# EAGLE schematic BMS Segment rev4 (EAGLE 8.4.1)
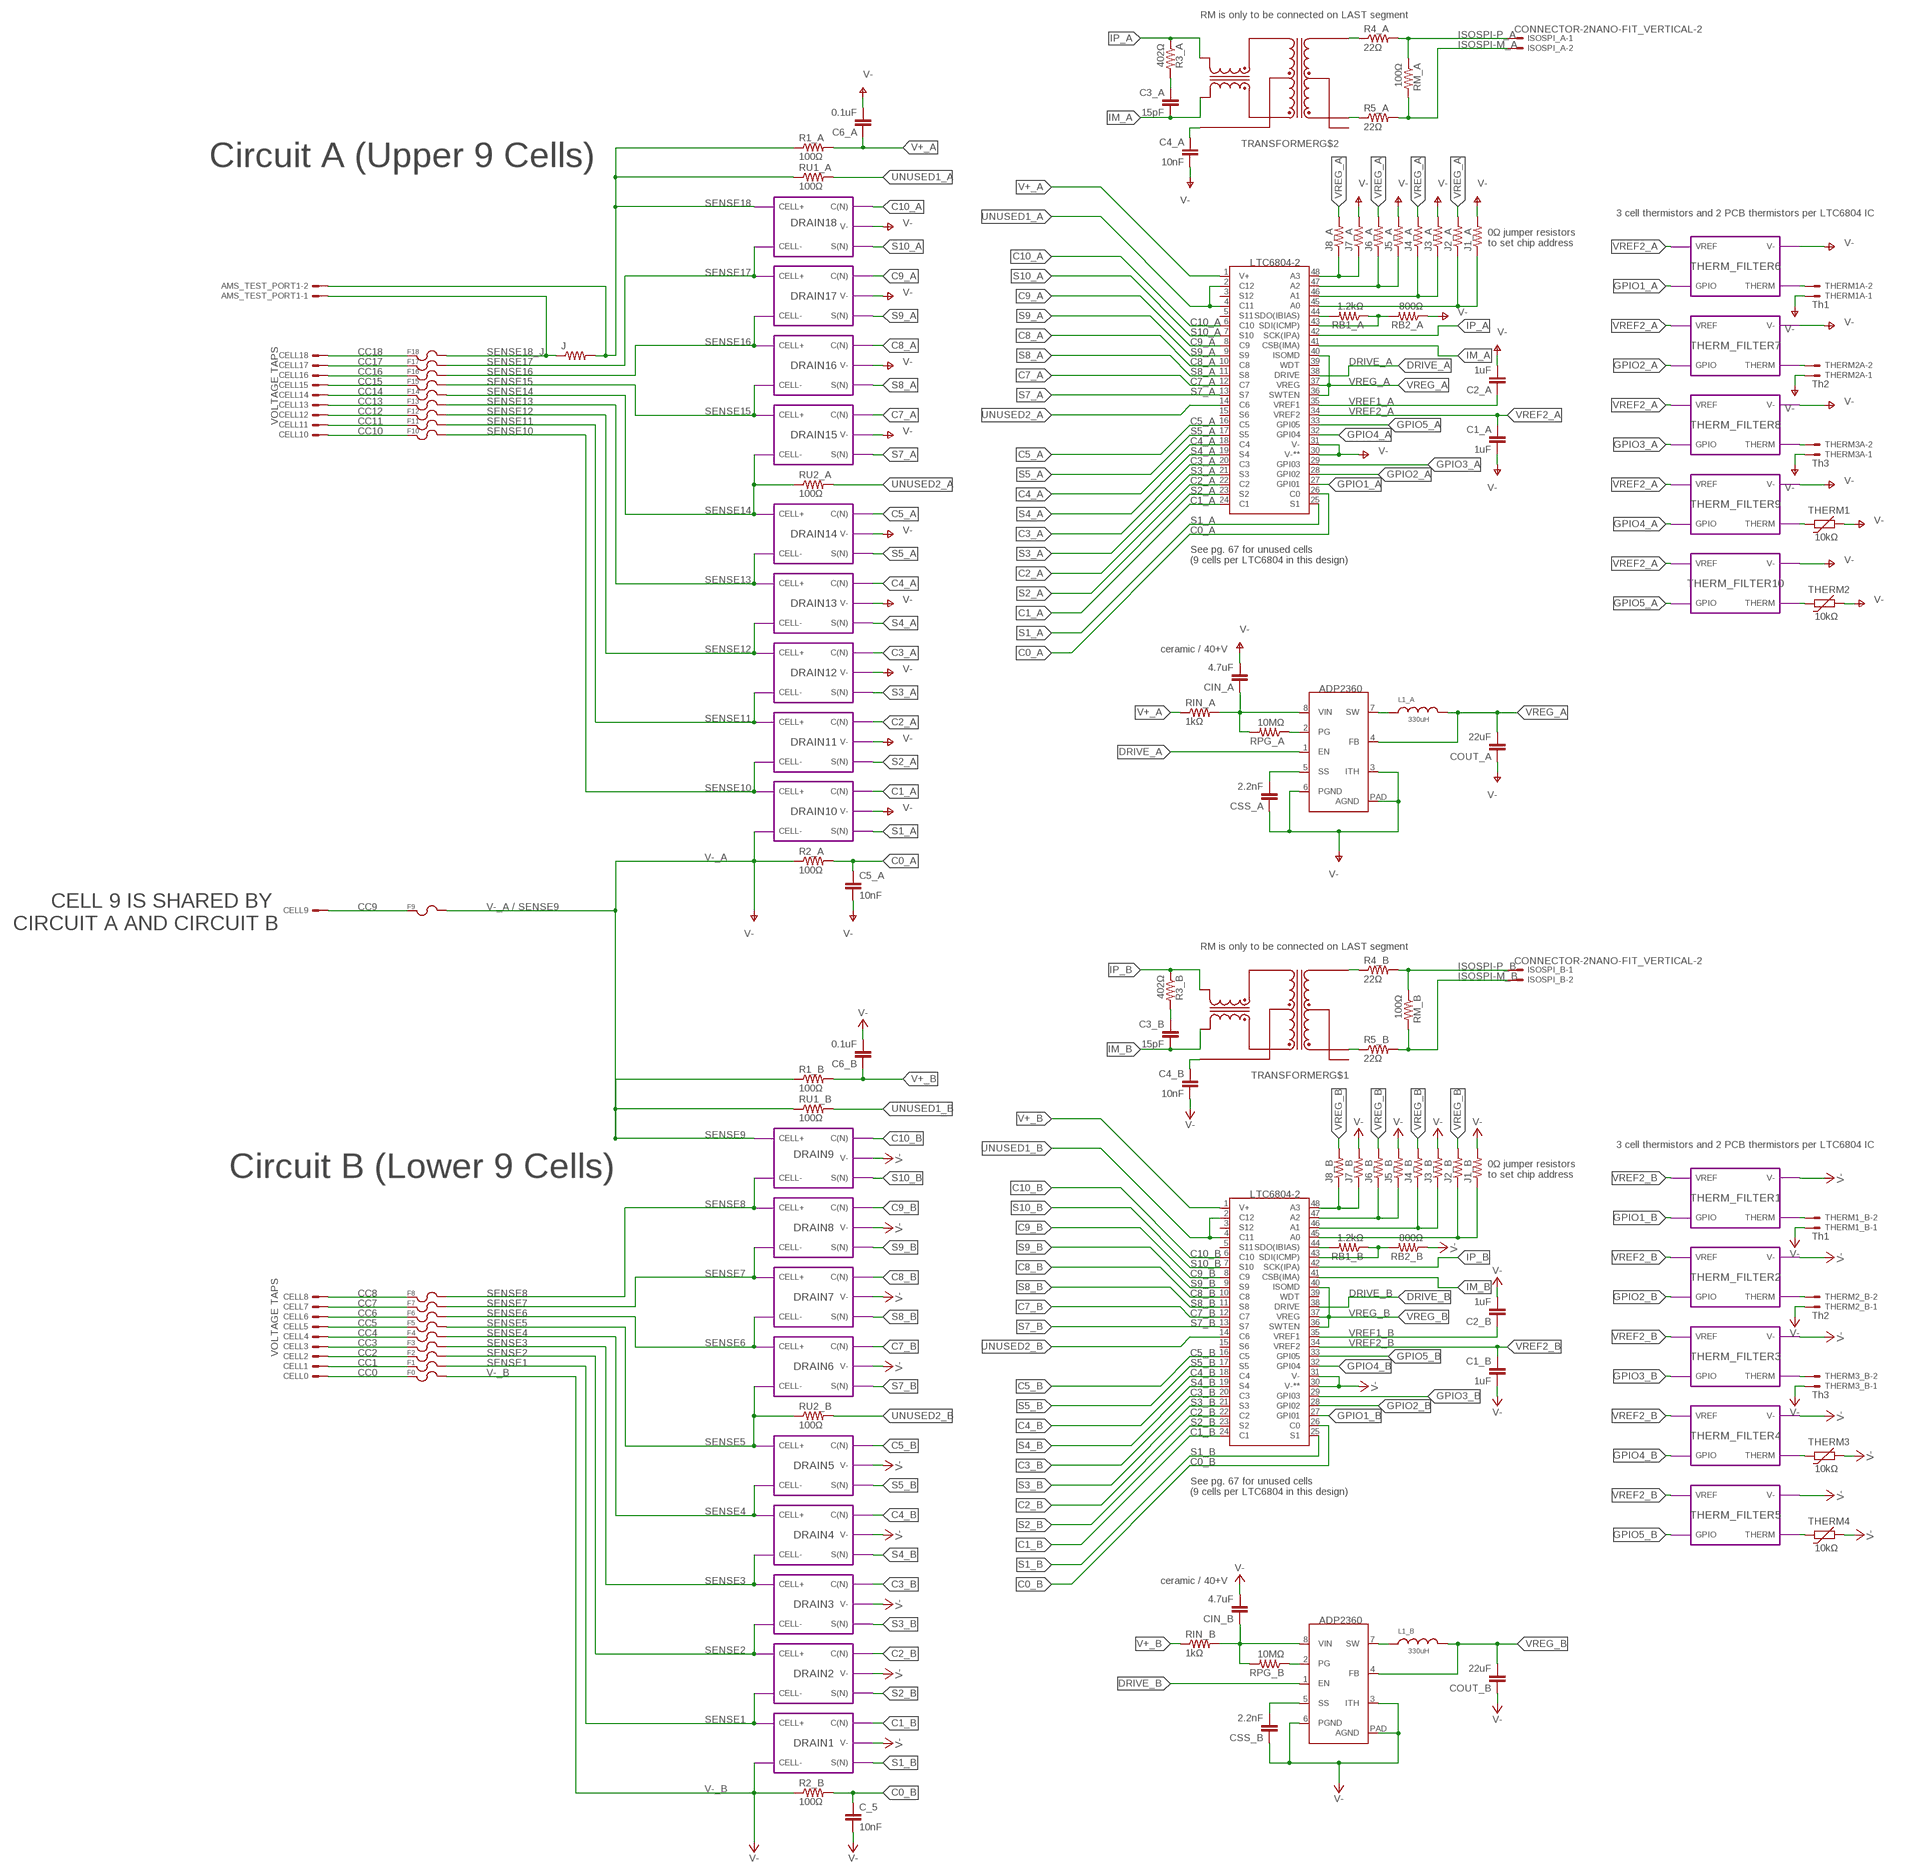
[diagram p0: schematic, sheet 1]

## Parts
AMS_TEST_PORT1  CONNECTOR-2NANO-FIT_VERTICAL-2  [NANO-FIT_VERTICAL-2]
BUCK_CONV_A  ADP2360  [LFCSP-8]
BUCK_CONV_B  ADP2360  [LFCSP-8]
C1_A  1uF  CAP0805  [0805]
C1_B  1uF  CAP0805  [0805]
C2_A  1uF  CAP0805  [0805]
C2_B  1uF  CAP0805  [0805]
C3_A  15pF  CAP0805  [0805]
C3_B  15pF  CAP0805  [0805]
C4_A  10nF  CAP0805  [0805]
C4_B  10nF  CAP0805  [0805]
C5_A  10nF  CAP0805  [0805]
C6_A  0.1uF  CAP0805  [0805]
C6_B  0.1uF  CAP0805  [0805]
C_5  10nF  CAP0805  [0805]
CELL0  BATTERY_SPRING_KEYSTONE5222  [KEYSTONE5222]
CELL1  BATTERY_SPRING_KEYSTONE5222  [KEYSTONE5222]
CELL2  BATTERY_SPRING_KEYSTONE5222  [KEYSTONE5222]
CELL3  BATTERY_SPRING_KEYSTONE5222  [KEYSTONE5222]
CELL4  BATTERY_SPRING_KEYSTONE5222  [KEYSTONE5222]
CELL5  BATTERY_SPRING_KEYSTONE5222  [KEYSTONE5222]
CELL6  BATTERY_SPRING_KEYSTONE5222  [KEYSTONE5222]
CELL7  BATTERY_SPRING_KEYSTONE5222  [KEYSTONE5222]
CELL8  BATTERY_SPRING_KEYSTONE5222  [KEYSTONE5222]
CELL9  BATTERY_SPRING_KEYSTONE5222  [KEYSTONE5222]
CELL10  BATTERY_SPRING_KEYSTONE5222  [KEYSTONE5222]
CELL11  BATTERY_SPRING_KEYSTONE5222  [KEYSTONE5222]
CELL12  BATTERY_SPRING_KEYSTONE5222  [KEYSTONE5222]
CELL13  BATTERY_SPRING_KEYSTONE5222  [KEYSTONE5222]
CELL14  BATTERY_SPRING_KEYSTONE5222  [KEYSTONE5222]
CELL15  BATTERY_SPRING_KEYSTONE5222  [KEYSTONE5222]
CELL16  BATTERY_SPRING_KEYSTONE5222  [KEYSTONE5222]
CELL17  BATTERY_SPRING_KEYSTONE5222  [KEYSTONE5222]
CELL18  BATTERY_SPRING_KEYSTONE5222  [KEYSTONE5222]
CIN_A  4.7uF  CAP0805  [0805]
CIN_B  4.7uF  CAP0805  [0805]
COUT_A  22uF  CAP0805  [0805]
COUT_B  22uF  CAP0805  [0805]
CSS_A  2.2nF  CAP0805  [0805]
CSS_B  2.2nF  CAP0805  [0805]
F0  0001.2704.11  [5X20MM_FUSE]
F1  0001.2704.11  [5X20MM_FUSE]
F2  0001.2704.11  [5X20MM_FUSE]
F3  0001.2704.11  [5X20MM_FUSE]
F4  0001.2704.11  [5X20MM_FUSE]
F5  0001.2704.11  [5X20MM_FUSE]
F6  0001.2704.11  [5X20MM_FUSE]
F7  0001.2704.11  [5X20MM_FUSE]
F8  0001.2704.11  [5X20MM_FUSE]
F9  0001.2704.11  [5X20MM_FUSE]
F10  0001.2704.11  [5X20MM_FUSE]
F11  0001.2704.11  [5X20MM_FUSE]
F12  0001.2704.11  [5X20MM_FUSE]
F13  0001.2704.11  [5X20MM_FUSE]
F14  0001.2704.11  [5X20MM_FUSE]
F15  0001.2704.11  [5X20MM_FUSE]
F16  0001.2704.11  [5X20MM_FUSE]
F17  0001.2704.11  [5X20MM_FUSE]
F18  0001.2704.11  [5X20MM_FUSE]
ISOSPI_A  CONNECTOR-2NANO-FIT_VERTICAL-2  [NANO-FIT_VERTICAL-2]
ISOSPI_B  CONNECTOR-2NANO-FIT_VERTICAL-2  [NANO-FIT_VERTICAL-2]
J  RESISTOR0805-RES  [0805]
J1_A  RESISTOR0805-RES  [0805]
J1_B  RESISTOR0805-RES  [0805]
J2_A  RESISTOR0805-RES  [0805]
J2_B  RESISTOR0805-RES  [0805]
J3_A  RESISTOR0805-RES  [0805]
J3_B  RESISTOR0805-RES  [0805]
J4_A  RESISTOR0805-RES  [0805]
J4_B  RESISTOR0805-RES  [0805]
J5_A  RESISTOR0805-RES  [0805]
J5_B  RESISTOR0805-RES  [0805]
J6_A  RESISTOR0805-RES  [0805]
J6_B  RESISTOR0805-RES  [0805]
J7_A  RESISTOR0805-RES  [0805]
J7_B  RESISTOR0805-RES  [0805]
J8_A  RESISTOR0805-RES  [0805]
J8_B  RESISTOR0805-RES  [0805]
L1_A  330uH  SRU1048  [SRU1048]
L1_B  330uH  SRU1048  [SRU1048]
R1_A  100Ω  RESISTOR0805-RES  [0805]
R1_B  100Ω  RESISTOR0805-RES  [0805]
R2_A  100Ω  RESISTOR0805-RES  [0805]
R2_B  100Ω  RESISTOR0805-RES  [0805]
R3_A  402Ω  RESISTOR0805-RES  [0805]
R3_B  402Ω  RESISTOR0805-RES  [0805]
R4_A  22Ω  RESISTOR0805-RES  [0805]
R4_B  22Ω  RESISTOR0805-RES  [0805]
R5_A  22Ω  RESISTOR0805-RES  [0805]
R5_B  22Ω  RESISTOR0805-RES  [0805]
RB1_A  1.2kΩ  RESISTOR0805-RES  [0805]
RB1_B  1.2kΩ  RESISTOR0805-RES  [0805]
RB2_A  800Ω  RESISTOR0805-RES  [0805]
RB2_B  800Ω  RESISTOR0805-RES  [0805]
RIN_A  1kΩ  RESISTOR0805-RES  [0805]
RIN_B  1kΩ  RESISTOR0805-RES  [0805]
RM_A  100Ω  RESISTOR0805-RES  [0805]
RM_B  100Ω  RESISTOR0805-RES  [0805]
RPG_A  10MΩ  RESISTOR0805-RES  [0805]
RPG_B  10MΩ  RESISTOR0805-RES  [0805]
RU1_A  100Ω  RESISTOR0805-RES  [0805]
RU1_B  100Ω  RESISTOR0805-RES  [0805]
RU2_A  100Ω  RESISTOR0805-RES  [0805]
RU2_B  100Ω  RESISTOR0805-RES  [0805]
THERM1  10kΩ  THERMISTOR_NCP210603  [0603]
THERM1_B  Th1  CONNECTOR-2NANO-FIT_VERTICAL-2  [NANO-FIT_VERTICAL-2]
THERM1A  Th1  CONNECTOR-2NANO-FIT_VERTICAL-2  [NANO-FIT_VERTICAL-2]
THERM2  10kΩ  THERMISTOR_NCP210603  [0603]
THERM2_B  Th2  CONNECTOR-2NANO-FIT_VERTICAL-2  [NANO-FIT_VERTICAL-2]
THERM2A  Th2  CONNECTOR-2NANO-FIT_VERTICAL-2  [NANO-FIT_VERTICAL-2]
THERM3  10kΩ  THERMISTOR_NCP210603  [0603]
THERM3_B  Th3  CONNECTOR-2NANO-FIT_VERTICAL-2  [NANO-FIT_VERTICAL-2]
THERM3A  Th3  CONNECTOR-2NANO-FIT_VERTICAL-2  [NANO-FIT_VERTICAL-2]
THERM4  10kΩ  THERMISTOR_NCP210603  [0603]
TRANSFORMER  SM51589PEL  [SM51589PEL]
U$1  LTC6804-2  [LTC6804]
U$2  LTC6804-2  [LTC6804]

## Module instances
DRAIN1 = DRAIN+FILTER
DRAIN2 = DRAIN+FILTER
DRAIN3 = DRAIN+FILTER
DRAIN4 = DRAIN+FILTER
DRAIN5 = DRAIN+FILTER
DRAIN6 = DRAIN+FILTER
DRAIN7 = DRAIN+FILTER
DRAIN8 = DRAIN+FILTER
DRAIN9 = DRAIN+FILTER
THERM_FILTER1 = THERM_FILTER
THERM_FILTER2 = THERM_FILTER
THERM_FILTER3 = THERM_FILTER
THERM_FILTER4 = THERM_FILTER
THERM_FILTER5 = THERM_FILTER
DRAIN10 = DRAIN+FILTER
DRAIN11 = DRAIN+FILTER
DRAIN12 = DRAIN+FILTER
DRAIN13 = DRAIN+FILTER
DRAIN14 = DRAIN+FILTER
DRAIN15 = DRAIN+FILTER
DRAIN16 = DRAIN+FILTER
DRAIN17 = DRAIN+FILTER
DRAIN18 = DRAIN+FILTER
THERM_FILTER6 = THERM_FILTER
THERM_FILTER7 = THERM_FILTER
THERM_FILTER8 = THERM_FILTER
THERM_FILTER9 = THERM_FILTER
THERM_FILTER10 = THERM_FILTER

## Nets
C0_A: C5_A.1 R2_A.2 U$1.26(C0)
C0_B: C_5.1 R2_B.2 U$2.26(C0)
C1_A: U$1.24(C1) ; port DRAIN10.C(N)
C1_B: U$2.24(C1) ; port DRAIN1.C(N)
C2_A: U$1.22(C2) ; port DRAIN11.C(N)
C2_B: U$2.22(C2) ; port DRAIN2.C(N)
C3_A: U$1.20(C3) ; port DRAIN12.C(N)
C3_B: U$2.20(C3) ; port DRAIN3.C(N)
C4_A: U$1.18(C4) ; port DRAIN13.C(N)
C4_B: U$2.18(C4) ; port DRAIN4.C(N)
C5_A: U$1.16(C5) ; port DRAIN14.C(N)
C5_B: U$2.16(C5) ; port DRAIN5.C(N)
C7_A: U$1.12(C7) ; port DRAIN15.C(N)
C7_B: U$2.12(C7) ; port DRAIN6.C(N)
C8_A: U$1.10(C8) ; port DRAIN16.C(N)
C8_B: U$2.10(C8) ; port DRAIN7.C(N)
C9_A: U$1.8(C9) ; port DRAIN17.C(N)
C9_B: U$2.8(C9) ; port DRAIN8.C(N)
C10_A: U$1.6(C10) ; port DRAIN18.C(N)
C10_B: U$2.6(C10) ; port DRAIN9.C(N)
CC0: CELL0.P$1(S) F0.P$1
CC1: CELL1.P$1(S) F1.P$1
CC2: CELL2.P$1(S) F2.P$1
CC3: CELL3.P$1(S) F3.P$1
CC4: CELL4.P$1(S) F4.P$1
CC5: CELL5.P$1(S) F5.P$1
CC6: CELL6.P$1(S) F6.P$1
CC7: CELL7.P$1(S) F7.P$1
CC8: CELL8.P$1(S) F8.P$1
CC9: CELL9.P$1(S) F9.P$1
CC10: CELL10.P$1(S) F10.P$1
CC11: CELL11.P$1(S) F11.P$1
CC12: CELL12.P$1(S) F12.P$1
CC13: CELL13.P$1(S) F13.P$1
CC14: CELL14.P$1(S) F14.P$1
CC15: CELL15.P$1(S) F15.P$1
CC16: CELL16.P$1(S) F16.P$1
CC17: CELL17.P$1(S) F17.P$1
CC18: CELL18.P$1(S) F18.P$1
DRIVE_A: BUCK_CONV_A.1(EN) U$1.38(DRIVE)
DRIVE_B: BUCK_CONV_B.1(EN) U$2.38(DRIVE)
GPIO1_A: U$1.27(GPI01) ; port THERM_FILTER6.GPIO
GPIO1_B: U$2.27(GPI01) ; port THERM_FILTER1.GPIO
GPIO2_A: U$1.28(GPI02) ; port THERM_FILTER7.GPIO
GPIO2_B: U$2.28(GPI02) ; port THERM_FILTER2.GPIO
GPIO3_A: U$1.29(GPI03) ; port THERM_FILTER8.GPIO
GPIO3_B: U$2.29(GPI03) ; port THERM_FILTER3.GPIO
GPIO4_A: U$1.32(GPI04) ; port THERM_FILTER9.GPIO
GPIO4_B: U$2.32(GPI04) ; port THERM_FILTER4.GPIO
GPIO5_A: U$1.33(GPI05) ; port THERM_FILTER10.GPIO
GPIO5_B: U$2.33(GPI05) ; port THERM_FILTER5.GPIO
IM_A: C3_A.2 TRANSFORMER.20(TD+) U$1.41(CSB(IMA))
IM_B: C3_B.2 TRANSFORMER.23(TD+) U$2.41(CSB(IMA))
IP_A: R3_A.1 TRANSFORMER.19(TD-) U$1.42(SCK(IPA))
IP_B: R3_B.1 TRANSFORMER.22(TD-) U$2.42(SCK(IPA))
ISOSPI-M_A: ISOSPI_A.P$2 R5_A.2 RM_A.2
ISOSPI-M_B: ISOSPI_B.P$2 R5_B.2 RM_B.2
ISOSPI-P_A: ISOSPI_A.P$1 R4_A.2 RM_A.1
ISOSPI-P_B: ISOSPI_B.P$1 R4_B.2 RM_B.1
N$1: C4_B.1 TRANSFORMER.24(TCT)
N$2: RB1_B.2 U$2.44(SDO(IBIAS))
N$3: THERM1_B.P$2 ; port THERM_FILTER1.THERM
N$4: RB1_B.1 RB2_B.2 U$2.43(SDI(ICMP))
N$5: R4_B.1 TRANSFORMER.3(MX-)
N$6: RB1_A.2 U$1.44(SDO(IBIAS))
N$7: R5_B.1 TRANSFORMER.2(MX+)
N$8: J7_B.1 J8_B.1 U$2.48(A3)
N$9: J5_B.1 J6_B.1 U$2.47(A2)
N$10: C3_B.1 R3_B.2
N$11: BUCK_CONV_B.8(VIN) CIN_B.1 RIN_B.2 RPG_B.2
N$12: BUCK_CONV_B.2(PG) RPG_B.1
N$13: J3_B.1 J4_B.1 U$2.46(A1)
N$14: BUCK_CONV_B.5(SS) CSS_B.2
N$15: BUCK_CONV_B.7(SW) L1_B.1
N$16: J1_B.1 J2_B.1 U$2.45(A0)
N$17: THERM4.2 ; port THERM_FILTER5.THERM
N$18: THERM2_B.P$2 ; port THERM_FILTER2.THERM
N$19: THERM3.2 ; port THERM_FILTER4.THERM
N$20: RB1_A.1 RB2_A.2 U$1.43(SDI(ICMP))
N$21: C4_A.1 TRANSFORMER.21(TCT)
N$22: R4_A.1 TRANSFORMER.6(MX-)
N$23: R5_A.1 TRANSFORMER.5(MX+)
N$24: C3_A.1 R3_A.2
N$25: BUCK_CONV_A.8(VIN) CIN_A.1 RIN_A.2 RPG_A.2
N$26: THERM3_B.P$2 ; port THERM_FILTER3.THERM
N$27: BUCK_CONV_A.2(PG) RPG_A.1
N$28: BUCK_CONV_A.5(SS) CSS_A.2
N$29: BUCK_CONV_A.7(SW) L1_A.1
N$30: J7_A.1 J8_A.1 U$1.48(A3)
N$31: J5_A.1 J6_A.1 U$1.47(A2)
N$32: J3_A.1 J4_A.1 U$1.46(A1)
N$33: J1_A.1 J2_A.1 U$1.45(A0)
N$34: THERM1.2 ; port THERM_FILTER9.THERM
N$35: THERM3A.P$2 ; port THERM_FILTER8.THERM
N$36: THERM2.2 ; port THERM_FILTER10.THERM
N$37: THERM2A.P$2 ; port THERM_FILTER7.THERM
N$38: THERM1A.P$2 ; port THERM_FILTER6.THERM
S1_A: U$1.25(S1) ; port DRAIN10.S(N)
S1_B: U$2.25(S1) ; port DRAIN1.S(N)
S2_A: U$1.23(S2) ; port DRAIN11.S(N)
S2_B: U$2.23(S2) ; port DRAIN2.S(N)
S3_A: U$1.21(S3) ; port DRAIN12.S(N)
S3_B: U$2.21(S3) ; port DRAIN3.S(N)
S4_A: U$1.19(S4) ; port DRAIN13.S(N)
S4_B: U$2.19(S4) ; port DRAIN4.S(N)
S5_A: U$1.17(S5) ; port DRAIN14.S(N)
S5_B: U$2.17(S5) ; port DRAIN5.S(N)
S7_A: U$1.13(S7) ; port DRAIN15.S(N)
S7_B: U$2.13(S7) ; port DRAIN6.S(N)
S8_A: U$1.11(S8) ; port DRAIN16.S(N)
S8_B: U$2.11(S8) ; port DRAIN7.S(N)
S9_A: U$1.9(S9) ; port DRAIN17.S(N)
S9_B: U$2.9(S9) ; port DRAIN8.S(N)
S10_A: U$1.7(S10) ; port DRAIN18.S(N)
S10_B: U$2.7(S10) ; port DRAIN9.S(N)
SENSE1: F1.P$2 ; port DRAIN1.CELL+ DRAIN2.CELL-
SENSE2: F2.P$2 ; port DRAIN2.CELL+ DRAIN3.CELL-
SENSE3: F3.P$2 ; port DRAIN3.CELL+ DRAIN4.CELL-
SENSE4: F4.P$2 ; port DRAIN4.CELL+ DRAIN5.CELL-
SENSE5: F5.P$2 RU2_B.1 ; port DRAIN5.CELL+ DRAIN6.CELL-
SENSE6: F6.P$2 ; port DRAIN6.CELL+ DRAIN7.CELL-
SENSE7: F7.P$2 ; port DRAIN7.CELL+ DRAIN8.CELL-
SENSE8: F8.P$2 ; port DRAIN8.CELL+ DRAIN9.CELL-
SENSE10: F10.P$2 ; port DRAIN10.CELL+ DRAIN11.CELL-
SENSE11: F11.P$2 ; port DRAIN11.CELL+ DRAIN12.CELL-
SENSE12: F12.P$2 ; port DRAIN12.CELL+ DRAIN13.CELL-
SENSE13: F13.P$2 ; port DRAIN13.CELL+ DRAIN14.CELL-
SENSE14: F14.P$2 RU2_A.1 ; port DRAIN14.CELL+ DRAIN15.CELL-
SENSE15: F15.P$2 ; port DRAIN15.CELL+ DRAIN16.CELL-
SENSE16: F16.P$2 ; port DRAIN16.CELL+ DRAIN17.CELL-
SENSE17: F17.P$2 ; port DRAIN17.CELL+ DRAIN18.CELL-
SENSE18: AMS_TEST_PORT1.P$2 J.2 R1_A.1 RU1_A.1 ; port DRAIN18.CELL+
SENSE18_J: AMS_TEST_PORT1.P$1 F18.P$2 J.1
UNUSED1_A: RU1_A.2 U$1.2(C12) U$1.4(C11)
UNUSED1_B: RU1_B.2 U$2.2(C12) U$2.4(C11)
UNUSED2_A: RU2_A.2 U$1.14(C6)
UNUSED2_B: RU2_B.2 U$2.14(C6)
V+_A: C6_A.1 R1_A.2 RIN_A.1 U$1.1(V+)
V+_B: C6_B.1 R1_B.2 RIN_B.1 U$2.1(V+)
V-_A: BUCK_CONV_A.3(ITH) BUCK_CONV_A.6(PGND) BUCK_CONV_A.PAD(AGND) C1_A.2 C2_A.2 C4_A.2 C5_A.2 C6_A.2 CIN_A.2 COUT_A.1 CSS_A.1 F9.P$2 J1_A.2 J3_A.2 J5_A.2 J7_A.2 R1_B.1 R2_A.1 RB2_A.1 RU1_B.1 THERM1.1 THERM1A.P$1 THERM2.1 THERM2A.P$1 THERM3A.P$1 U$1.30(V-**) U$1.31(V-) ; port DRAIN10.CELL- DRAIN9.CELL+ DRAIN18.V- DRAIN17.V- DRAIN16.V- DRAIN15.V- DRAIN14.V- DRAIN13.V- DRAIN12.V- DRAIN11.V- DRAIN10.V- THERM_FILTER6.V- THERM_FILTER7.V- THERM_FILTER8.V- THERM_FILTER9.V- THERM_FILTER10.V- ; supply symbol labelled V-
V-_B: BUCK_CONV_B.3(ITH) BUCK_CONV_B.6(PGND) BUCK_CONV_B.PAD(AGND) C1_B.2 C2_B.2 C4_B.2 C6_B.2 C_5.2 CIN_B.2 COUT_B.1 CSS_B.1 F0.P$2 J1_B.2 J3_B.2 J5_B.2 J7_B.2 R2_B.1 RB2_B.1 THERM1_B.P$1 THERM2_B.P$1 THERM3.1 THERM3_B.P$1 THERM4.1 U$2.30(V-**) U$2.31(V-) ; port DRAIN1.CELL- DRAIN9.V- DRAIN8.V- DRAIN7.V- DRAIN6.V- DRAIN5.V- DRAIN4.V- DRAIN3.V- DRAIN2.V- DRAIN1.V- THERM_FILTER1.V- THERM_FILTER2.V- THERM_FILTER3.V- THERM_FILTER4.V- THERM_FILTER5.V- ; supply symbol labelled V-
VREF1_A: C2_A.1 U$1.35(VREF1)
VREF1_B: C2_B.1 U$2.35(VREF1)
VREF2_A: C1_A.1 U$1.34(VREF2) ; port THERM_FILTER6.VREF THERM_FILTER7.VREF THERM_FILTER8.VREF THERM_FILTER9.VREF THERM_FILTER10.VREF
VREF2_B: C1_B.1 U$2.34(VREF2) ; port THERM_FILTER4.VREF THERM_FILTER5.VREF THERM_FILTER3.VREF THERM_FILTER2.VREF THERM_FILTER1.VREF
VREG_A: BUCK_CONV_A.4(FB) COUT_A.2 J2_A.2 J4_A.2 J6_A.2 J8_A.2 L1_A.2 U$1.36(SWTEN) U$1.37(VREG) U$1.40(ISOMD)
VREG_B: BUCK_CONV_B.4(FB) COUT_B.2 J2_B.2 J4_B.2 J6_B.2 J8_B.2 L1_B.2 U$2.36(SWTEN) U$2.37(VREG) U$2.40(ISOMD)
Unconnected: TRANSFORMER.1(MCT) TRANSFORMER.4(MCT) TRANSFORMER.7(MCT) TRANSFORMER.8(MX+) TRANSFORMER.9(MX-) TRANSFORMER.10(MCT) TRANSFORMER.11(MX+) TRANSFORMER.12(MX-) TRANSFORMER.13(TD-) TRANSFORMER.14(TD+) TRANSFORMER.15(TCT) TRANSFORMER.16(TD-) TRANSFORMER.17(TD+) TRANSFORMER.18(TCT) U$1.3(S12) U$1.5(S11) U$1.15(S6) U$1.39(WDT) U$2.3(S12) U$2.5(S11) U$2.15(S6) U$2.39(WDT)

## Notes on the sheet
- RM is only to be connected on LAST segment
- Circuit A (Upper 9 Cells)
- 3 cell thermistors and 2 PCB thermistors per LTC6804 IC
- 0Ω jumper resistors
  to set chip address
- LTC6804-2
- VOLTAGE TAPS
- See pg. 67 for unused cells
  (9 cells per LTC6804 in this design)
- ceramic / 40+V
- ADP2360
- V-_A / SENSE9
- CELL 9 IS SHARED BY 
  CIRCUIT A AND CIRCUIT B
- RM is only to be connected on LAST segment
- SENSE9
- 3 cell thermistors and 2 PCB thermistors per LTC6804 IC
- Circuit B (Lower 9 Cells)
- 0Ω jumper resistors
  to set chip address
- LTC6804-2
- VOLTAGE TAPS
- See pg. 67 for unused cells
  (9 cells per LTC6804 in this design)
- ceramic / 40+V
- ADP2360

## Library data of the parts
AMS_TEST_PORT1 ISOSPI_A ISOSPI_B THERM1_B THERM1A THERM2_B THERM2A THERM3_B THERM3A = HyTechDevices:CONNECTOR-2: Mini-Fit Junior connector 2 pole Source: http://www.molex.com
BUCK_CONV_A BUCK_CONV_B = HyTechDevices:ADP2360: Analog Devices High Efficiency Buck Regulator Input Voltage Range: 4.5V - 60V Output Voltage: 5V (fixed) Output Current: 50 mA (max) Datasheet <http://www.mouser.com/ds/2/609/ADP2360-961379.pdf>
C1_A C1_B C2_A C2_B C3_A C3_B C4_A C4_B C5_A C6_A C6_B C_5 CIN_A CIN_B COUT_A COUT_B CSS_A CSS_B = HyTechDevices:CAP: Capacitor Standard 0603 ceramic capacitor, and 0.1" leaded capacitor.
CELL0 CELL1-CELL18 = HyTechDevices:BATTERY_SPRING: Keystone Electronics Battery Spring Contact Datasheet <http://keyelco.com/userAssets/file/M65p17.pdf>
F0 F1-F18 = HyTechDevices:0001.2704.11: Schurter Surface Mount Ceramic Fuse Current Rating: 1A Voltage Rating AC: 250 VAC Voltage Rating DC: 300 VDC Dimensions: 5 mm x 20 mm Datasheet <http://www.mouser.com/ds/2/358/typ_SMD-SPT-46594.pdf>
J J1_A J1_B J2_A J2_B J3_A J3_B J4_A J4_B J5_A J5_B J6_A J6_B J7_A J7_B J8_A J8_B R1_A R1_B R2_A R2_B R3_A R3_B R4_A R4_B R5_A R5_B RB1_A RB1_B RB2_A RB2_B RIN_A RIN_B RM_A RM_B RPG_A RPG_B RU1_A RU1_B RU2_A RU2_B = HyTechDevices:RESISTOR: Resistor Basic schematic elements and footprints for 0603, 1206, and PTH resistors.
L1_A L1_B = HyTechDevices:SRU1048: Bourns SRU1048 Series Shielded SMD Power Inductor Datasheet <http://www.mouser.com/ds/2/54/RU1048-778161.pdf>
THERM1-THERM4 = HyTechDevices:THERMISTOR_NCP21: Murata NCP Thermistor Datasheet <http://www.murata.com/~/media/webrenewal/support/library/catalog/products/thermistor/ntc/r44e.ashx>
TRANSFORMER = HyTechDevices:SM51589PEL: Bourns High Isolation LAN Transformer Module 5000 VAC Isolation Turns Ratio: 1CT:1CT Inductance: 350 uH Leakage Inductance: 0.5 uH Datasheet <http://www.mouser.com/ds/2/54/m51589pel-778121.pdf>
U$1 U$2 = HyTechDevices:LTC6804-2: Linear Technology Multicell Battery Stack Monitor Variant 2: Addressable/Multi-Drop Configuration Datasheet <http://cds.linear.com/docs/en/datasheet/680412fc.pdf>

## Module DRAIN+FILTER
Ports: CELL+(in) CELL-(out) S(N)(in) C(N)(out) V-(pwr)
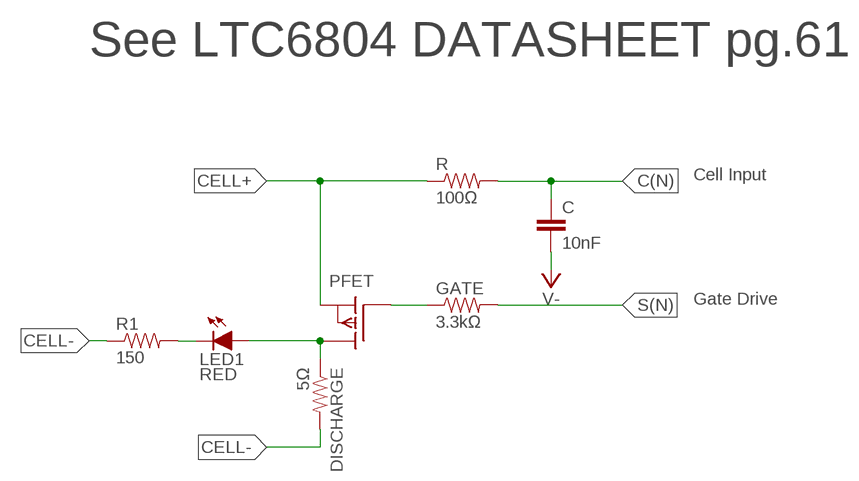
[diagram p1: schematic, module DRAIN+FILTER, sheet 1]

### Parts
C  10nF  CAP0805  [0805]
DISCHARGE  5Ω  RESISTORPWR163  [PWR163]
GATE  3.3kΩ  RESISTOR0805-RES  [0805]
LED1  RED  LED-0805  [LED-805]
PFET  P-CHANNEL_MOSFET_DMP3099L-7  [SOT23]
R  100Ω  RESISTOR0805-RES  [0805]
R1  150  RESISTOR0805-RES  [0805]

### Nets
C(N): C.1 R.2
CELL+: PFET.2(S) R.1
CELL-: DISCHARGE.2 R1.1
GATE: GATE.1 PFET.1(G)
N$1: DISCHARGE.1 LED1.A PFET.3(D)
N$2: LED1.C R1.2
S(N): GATE.2
V-: C.2

### Notes on the sheet
- See LTC6804 DATASHEET pg.61
- Cell Input
- Gate Drive

### Library data of the parts
C = HyTechDevices:CAP: Capacitor Standard 0603 ceramic capacitor, and 0.1" leaded capacitor.
DISCHARGE GATE R R1 = HyTechDevices:RESISTOR: Resistor Basic schematic elements and footprints for 0603, 1206, and PTH resistors.
LED1 = HyTechDevices:LED: Light Emitting Diode (LED) Source: Dangerous Prototypes Eagle Library <https://github.com/DangerousPrototypes/Eagle_Part_Library>
PFET = HyTechDevices:P-CHANNEL_MOSFET_DMP3099L-7: Diodes Incorporated P-Channel Enhancement Mode MOSFET Datasheet <http://www.mouser.com/ds/2/115/DMP3099L-266220.pdf>

## Module THERM_FILTER
Ports: VREF(pwr) GPIO(out) THERM(nc) V-(pwr)
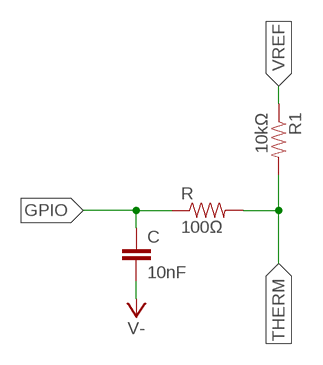
[diagram p2: schematic, module THERM_FILTER, sheet 1]

### Parts
C  10nF  CAP0805  [0805]
R  100Ω  RESISTOR0805-RES  [0805]
R1  10kΩ  RESISTOR0805-RES  [0805]

### Nets
GPIO: C.1 R.1
THERM: R1.2 R.2
V-: C.2
VREF: R1.1

### Library data of the parts
C = HyTechDevices:CAP: Capacitor Standard 0603 ceramic capacitor, and 0.1" leaded capacitor.
R R1 = HyTechDevices:RESISTOR: Resistor Basic schematic elements and footprints for 0603, 1206, and PTH resistors.